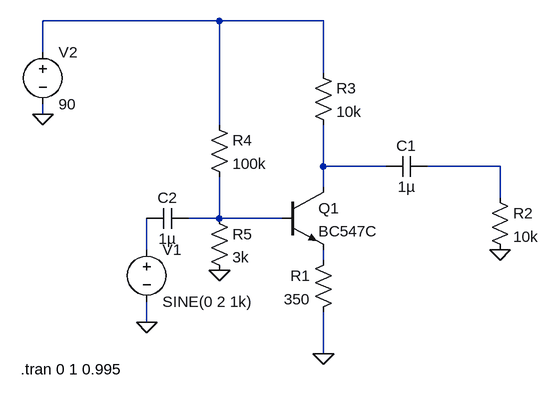
[diagram p0: schematic Draft2.asc]
Draft2.asc, the LTspice schematic file:
Version 4
SHEET 1 880 680
WIRE -144 -48 -416 -48
WIRE 16 -48 -144 -48
WIRE -416 0 -416 -48
WIRE 16 32 16 -48
WIRE -416 96 -416 80
WIRE -144 112 -144 -48
WIRE 16 176 16 112
WIRE 112 176 16 176
WIRE 288 176 176 176
WIRE 16 208 16 176
WIRE 288 224 288 176
WIRE -144 256 -144 192
WIRE -144 256 -192 256
WIRE -48 256 -144 256
WIRE -256 304 -256 256
WIRE 16 320 16 304
WIRE -256 416 -256 384
WIRE 16 464 16 400
FLAG -256 416 0
FLAG 288 304 0
FLAG 16 464 0
FLAG -416 96 0
FLAG -144 336 0
SYMBOL npn -48 208 R0
SYMATTR InstName Q1
SYMATTR Value BC547C
SYMBOL res 32 304 M0
SYMATTR InstName R1
SYMATTR Value 350
SYMBOL voltage -256 288 R0
WINDOW 123 0 0 Left 0
WINDOW 39 0 0 Left 0
SYMATTR InstName V1
SYMATTR Value SINE(0 2 1k)
SYMBOL res 272 208 R0
SYMATTR InstName R2
SYMATTR Value 10k
SYMBOL res 0 16 R0
SYMATTR InstName R3
SYMATTR Value 10k
SYMBOL cap 176 160 R90
WINDOW 0 0 32 VBottom 2
WINDOW 3 32 32 VTop 2
SYMATTR InstName C1
SYMATTR Value 1µ
SYMBOL cap -192 240 R90
WINDOW 0 0 32 VBottom 2
WINDOW 3 32 32 VTop 2
SYMATTR InstName C2
SYMATTR Value 1µ
SYMBOL voltage -416 -16 R0
WINDOW 123 0 0 Left 0
WINDOW 39 0 0 Left 0
SYMATTR InstName V2
SYMATTR Value 90
SYMBOL res -160 96 R0
SYMATTR InstName R4
SYMATTR Value 100k
SYMBOL res -160 240 R0
SYMATTR InstName R5
SYMATTR Value 3k
TEXT -450 488 Left 2 !.tran 0 1 0.995

The netlist it stands for:
* Draft2.asc
Q1 N002 N004 N006 0 BC547C
R1 N006 0 350
V1 N005 0 SINE(0 2 1k)
R2 N003 0 10k
R3 N001 N002 10k
C1 N003 N002 1µ
C2 N004 N005 1µ
V2 N001 0 90
R4 N001 N004 100k
R5 N004 0 3k
.model NPN NPN
.model PNP PNP
.lib standard.bjt
.tran 0 1 0.995
.backanno
.end